# EAGLE design Squematico2.0 (EAGLE 9.6.2)
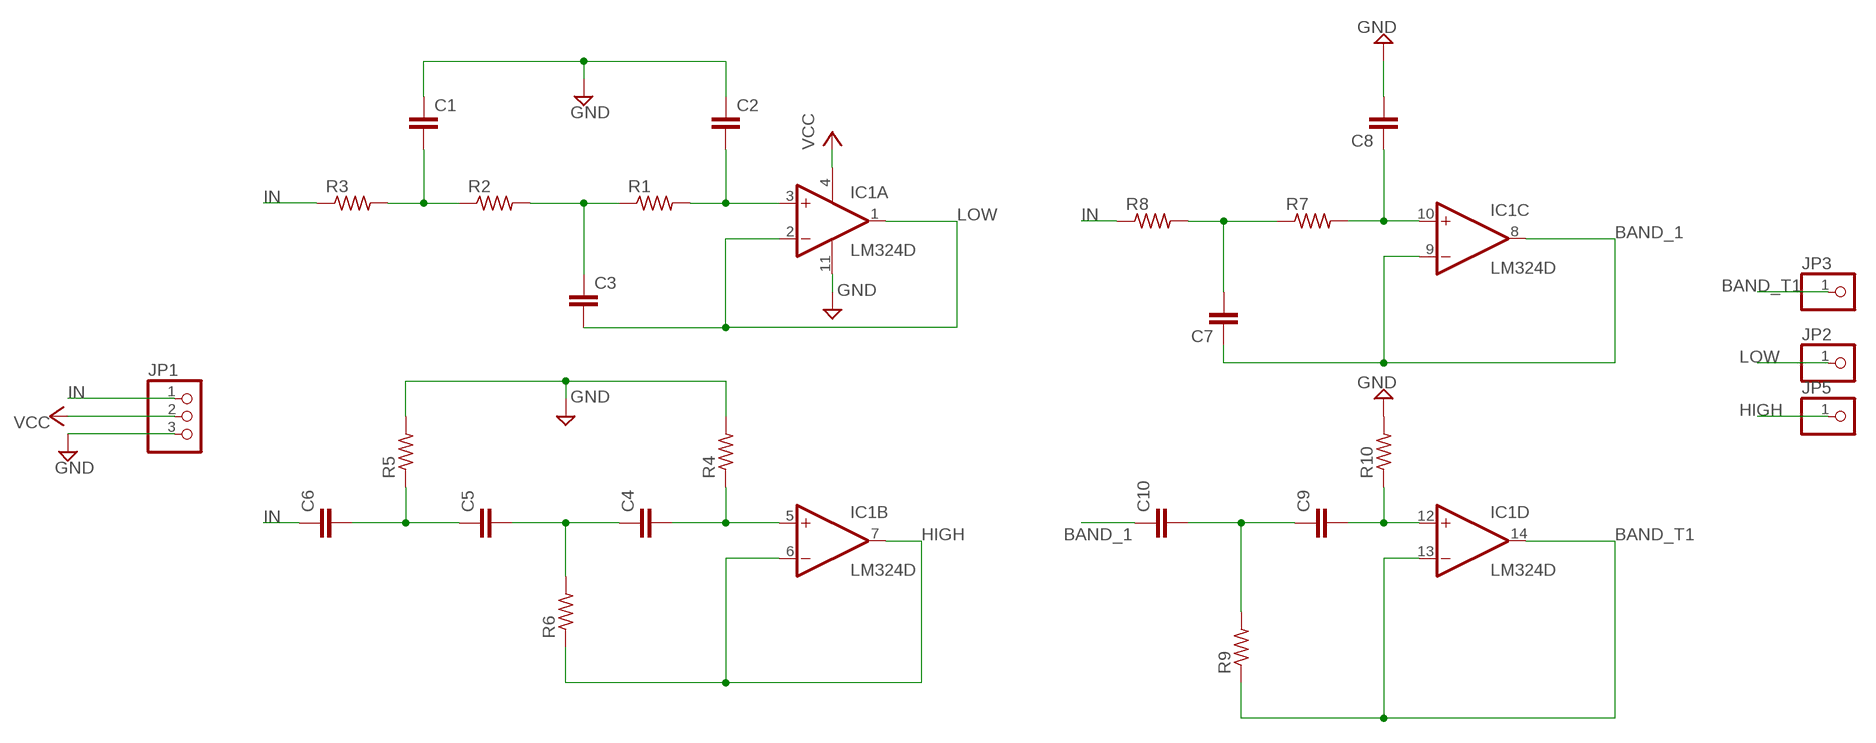
[diagram p0: schematic, sheet 1]

## Parts
C1  C-EU025-025X050  [C025-025X050]
C2  C-EU025-025X050  [C025-025X050]
C3  C-EU025-025X050  [C025-025X050]
C4  C-EU025-025X050  [C025-025X050]
C5  C-EU025-025X050  [C025-025X050]
C6  C-EU025-025X050  [C025-025X050]
C7  C-EU025-025X050  [C025-025X050]
C8  C-EU025-025X050  [C025-025X050]
C9  C-EU025-025X050  [C025-025X050]
C10  C-EU025-025X050  [C025-025X050]
IC1  LM324D  [SO14]
JP1  PINHD-1X3  [1X03]
JP2  PINHD-1X1  [1X01]
JP3  PINHD-1X1  [1X01]
JP5  PINHD-1X1  [1X01]
R1  R-US_0204/7  [0204/7]
R2  R-US_0204/7  [0204/7]
R3  R-US_0204/7  [0204/7]
R4  R-US_0204/7  [0204/7]
R5  R-US_0204/7  [0204/7]
R6  R-US_0204/7  [0204/7]
R7  R-US_0204/7  [0204/7]
R8  R-US_0204/7  [0204/7]
R9  R-US_0204/7  [0204/7]
R10  R-US_0204/7  [0204/7]

## Nets
BAND_1: C7.1 C10.1 IC1.8(C:OUT) IC1.9(C:-IN)
BAND_T1: IC1.13(D:-IN) IC1.14(D:OUT) JP3.1 R9.1
GND: C1.1 C2.1 C8.2 IC1.11(P:V-) JP1.3 R4.2 R5.2 R10.2
HIGH: IC1.6(B:-IN) IC1.7(B:OUT) JP5.1 R6.1
IN: C6.1 JP1.1 R3.1 R8.1
LOW: C3.2 IC1.1(A:OUT) IC1.2(A:-IN) JP2.1
N$1: C2.2 IC1.3(A:+IN) R1.2
N$2: C3.1 R1.1 R2.2
N$3: C1.2 R2.1 R3.2
N$4: C4.2 IC1.5(B:+IN) R4.1
N$6: C4.1 C5.2 R6.2
N$7: C5.1 C6.2 R5.1
N$8: C7.2 R7.1 R8.2
N$9: C8.1 IC1.10(C:+IN) R7.2
N$11: C9.2 IC1.12(D:+IN) R10.1
N$14: C9.1 C10.2 R9.2
VCC: IC1.4(P:V+) JP1.2

## Library data of the parts
C1-C10 = rcl:C-EU: CAPACITOR, European symbol; SPICEPREFIX: C
IC1 = linear:LM324: OP AMP
JP1 = pinhead:PINHD-1X3: PIN HEADER
JP2 JP3 JP5 = pinhead:PINHD-1X1: PIN HEADER
R1-R10 = rcl:R-US_: RESISTOR, American symbol; SPICEPREFIX: R

## Board
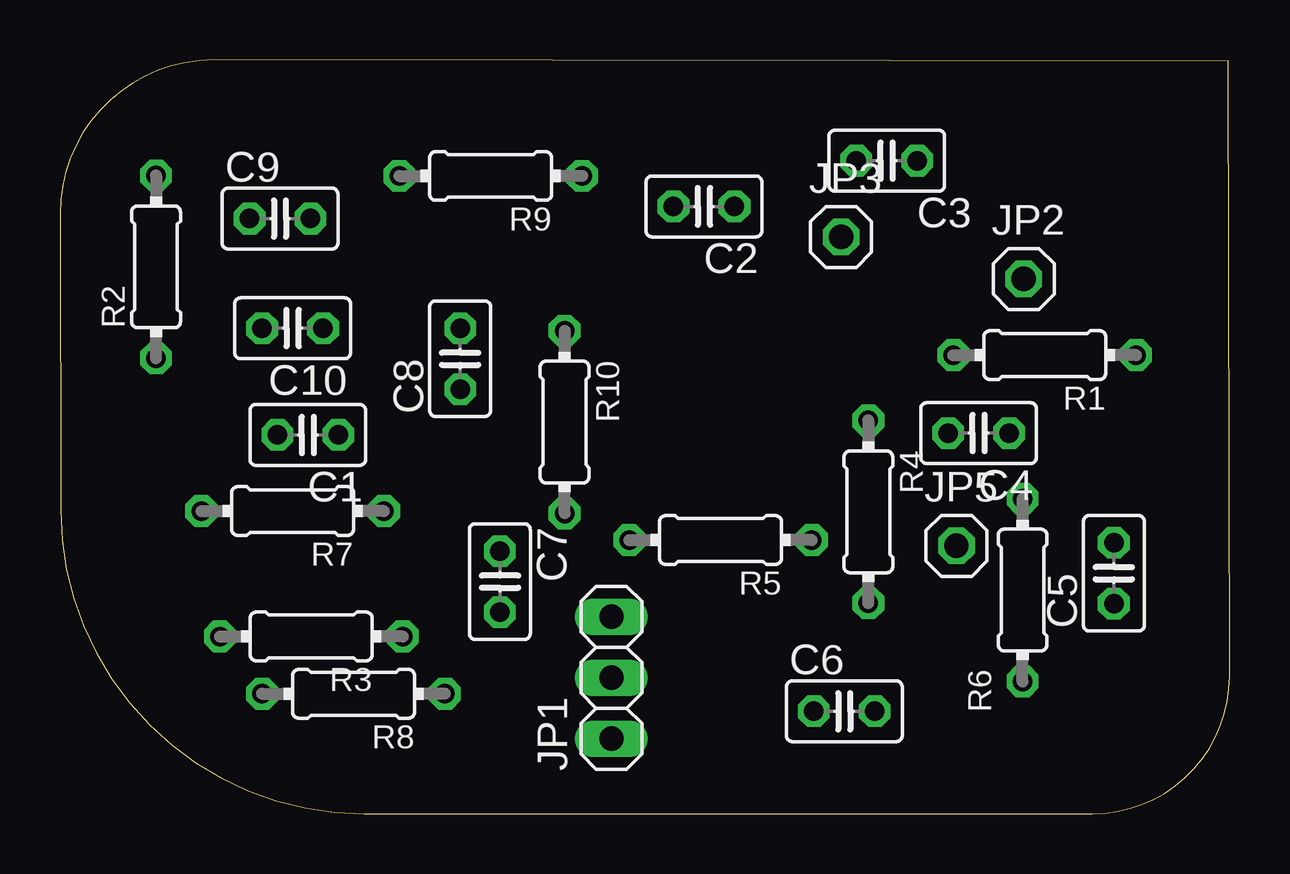
[diagram p1: board, top side]
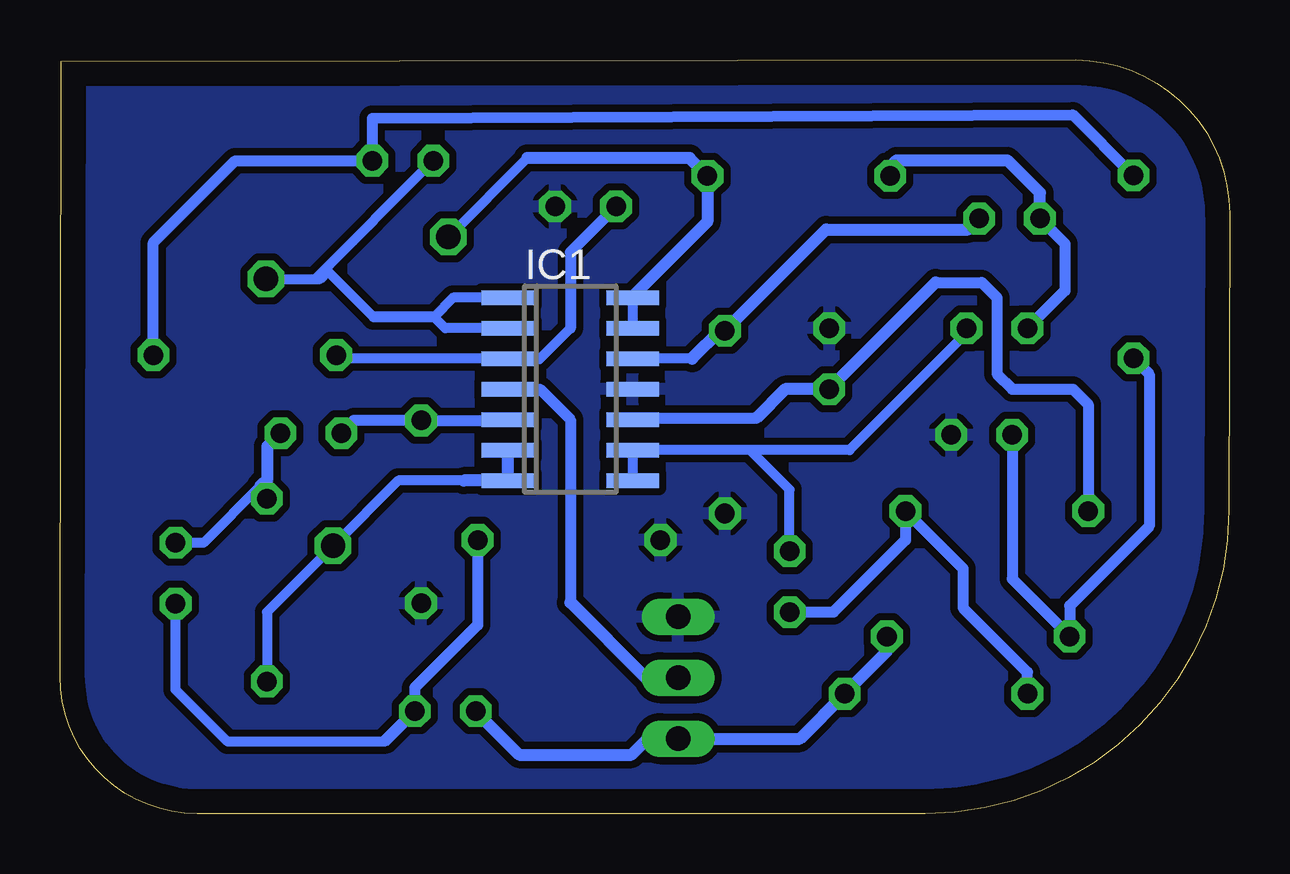
[diagram p2: board, bottom side, seen from below]

Size 48.75 x 31.42 mm. Coordinates in mm from the lower left corner, seen from the top.
Outline: 12.68,0 43.04,0 arc90 48.75,5.72 48.71,31.37 6.41,31.42 arc90 0,25.01 0.02,12.64 arc90 12.68,0
Copper layers (1*16): Top 0.035mm / dielectric 1.5mm / Bottom 0.035mm
Design rules "default *": minimum track width 6mil, minimum drill 0.5mm, track to track 12mil, track to pad 10mil, pad to pad 6mil, via to via 6mil, smd to smd 6mil, copper to edge 40mil, drill to drill 6mil, minimum pad ring 10mil, minimum via ring 8mil, stop-mask expansion 4mil, vias tented up to drill 0mil, thermal gap 10mil

### Footprints (pad centres in the part's own frame; a part is rotated, then mirrored left to right if it is on the bottom)
C025-025X050 = drill 0.813 octagon: 1 -1.27,0; 2 1.27,0
SO14 = smd 0.6 x 2.2: 1 -3.81,-2.6; 2 -2.54,-2.6; 3 -1.27,-2.6; 4 0,-2.6; 5 1.27,-2.6; 6 2.54,-2.6; 7 3.81,-2.6; 8 3.81,2.6; 9 2.54,2.6; 10 1.27,2.6; 11 0,2.6; 12 -1.27,2.6; 13 -2.54,2.6; 14 -3.81,2.6
1X03 = drill 1.016 long: 1 -2.54,0; 2 0,0; 3 2.54,0
1X01 = drill 1.016 octagon: 1 0,0
0204/7 = drill 0.813 octagon: 1 -3.81,0; 2 3.81,0

### Placement (x,y rotation side)
C1  10.33,15.79 180 top
C2  26.84,25.32 180 top
C3  34.46,27.22 180 top
C4  38.29,15.86 180 top
C5  43.93,10.02 90 top
C6  32.69,4.27 0 top
C7  18.34,9.67 270 top
C8  16.68,18.97 90 top
C9  9.17,24.81 0 top
C10  9.7,20.24 180 top
IC1  27.48,17.7 270 bottom
JP1  22.99,5.67 90 top
JP2  40.17,22.29 0 top
JP3  32.56,24.04 0 top
JP5  37.37,11.17 0 top
R1  41.05,19.12 180 top
R2  4.01,22.8 90 top
R3  10.47,7.39 180 top
R4  33.69,12.58 270 top
R5  27.53,11.41 180 top
R6  40.12,9.32 90 top
R7  9.7,12.62 180 top
R8  12.24,5 180 top
R9  17.95,26.59 180 top
R10  21.03,16.32 270 top

### Tracks (layer width: path | path; a pad name or v marks a point on that pad's centre or on a via)
BAND_1
  Bottom 0.406: C10.1 10.97,20.03 15.84,15.15 19.98,15.15 | IC1.8 IC1.9 19.98,15.15 | C7.1 18.33,13.51 19.98,15.15
BAND_T1
  Bottom 0.152: IC1.14 24.88,21.57
  Bottom 0.406: IC1.14 IC1.13 | 29.27,27.33 JP3.1
  Bottom 0.508: 24.88,21.57 21.76,24.68 R9.1 22.5,27.33 29.27,27.33
GND
  pour Bottom: 42.95,1.19 12.16,1.19 arc-90 0.81,12.54 0.81,24.9 arc-90 6.41,30.5 47.8,30.5 47.8,6.03 arc-90
HIGH
  Bottom 0.406: 31.92,13.88 34.65,13.88 JP5.1 40.12,8.41 R6.1
  Bottom 0.508: IC1.6 IC1.7 31.92,13.88
IN
  Bottom 0.508: R3.1 14.28,6.76 R8.1 17.91,3.13 JP1.1 24.26,3.13 24.94,2.46 29.61,2.46 C6.1
LOW
  Bottom 0.406: JP2.1 38.12,22.29 | 38.12,22.29 37.92,22.29 37.59,22.62 35.68,20.71 | IC1.1 32.37,21.5 33.16,20.71 32.69,20.23 IC1.2 | C3.2 38.12,22.29
  Bottom 0.457: 33.16,20.71 35.68,20.71
N$1
  Bottom 0.406: 27.48,20.23 28.76,18.95 30.06,18.95 IC1.3 37.09,18.96 R1.2
  Bottom 0.457: C2.2 27.48,23.41 27.48,20.23
N$2
  Bottom 0.457: R2.2 6.54,29.14 35.73,28.98 C3.1 41.45,27.22 44.86,23.81 R1.1
N$3
  Bottom 0.457: C1.2 9.06,9.79 R3.2 6.66,8.67 3.35,11.98 3.35,18.33 R2.1
N$4
  Bottom 0.457: IC1.5 30.11,16.39 R4.1 36.49,16.39 C4.2
N$6
  Bottom 0.406: 40.39,13.68 42.77,11.29 C5.2
  Bottom 0.508: C4.1 40.1,15.33 40.1,13.96 40.12,13.94 | 40.12,13.94 40.39,13.68 | R6.2 40.12,13.94
N$7
  Bottom 0.406: 35.16,3.07 35.24,3 41.75,3 43.93,5.17 C5.1
  Bottom 0.457: R5.1 31.34,7.87 33.96,5.25 C6.2
  Bottom 0.508: C6.2 35.16,3.07
N$8
  Bottom 0.457: R8.2 8.43,5.9 11.11,8.58 11.11,10.22 R7.1 13.51,11.4 16.5,8.4 C7.2
N$9
  Bottom 0.457: IC1.10 24.8,16.5 19.72,16.5 | 12.26,22.14 10.33,22.14 9.7,21.5 9.7,18.33 9.06,17.7 6.52,17.7 5.89,17.06 R7.2
  Bottom 0.508: 12.26,22.14 16.68,17.71 C8.1 18.53,17.7 19.72,16.5
N$11
  Bottom 0.406: 22.4,18.96 IC1.12
  Bottom 0.508: C9.2 10.9,24.35 16.82,24.35 R10.1 21.23,20.14 22.4,18.96
N$14
  Bottom 0.457: C9.1 6.86,23.76 6.86,21.81 C10.2
  Bottom 0.508: C9.1 7.9,25.88 9.26,27.24 13.88,27.24 14.14,26.98 R9.2
VCC
  Bottom 0.457: IC1.4 28.75,17.7 27.48,16.43 27.48,8.8
  Bottom 0.508: JP1.2 24.34,5.67 27.48,8.8